# EAGLE design W506X (EAGLE 6.6.0)
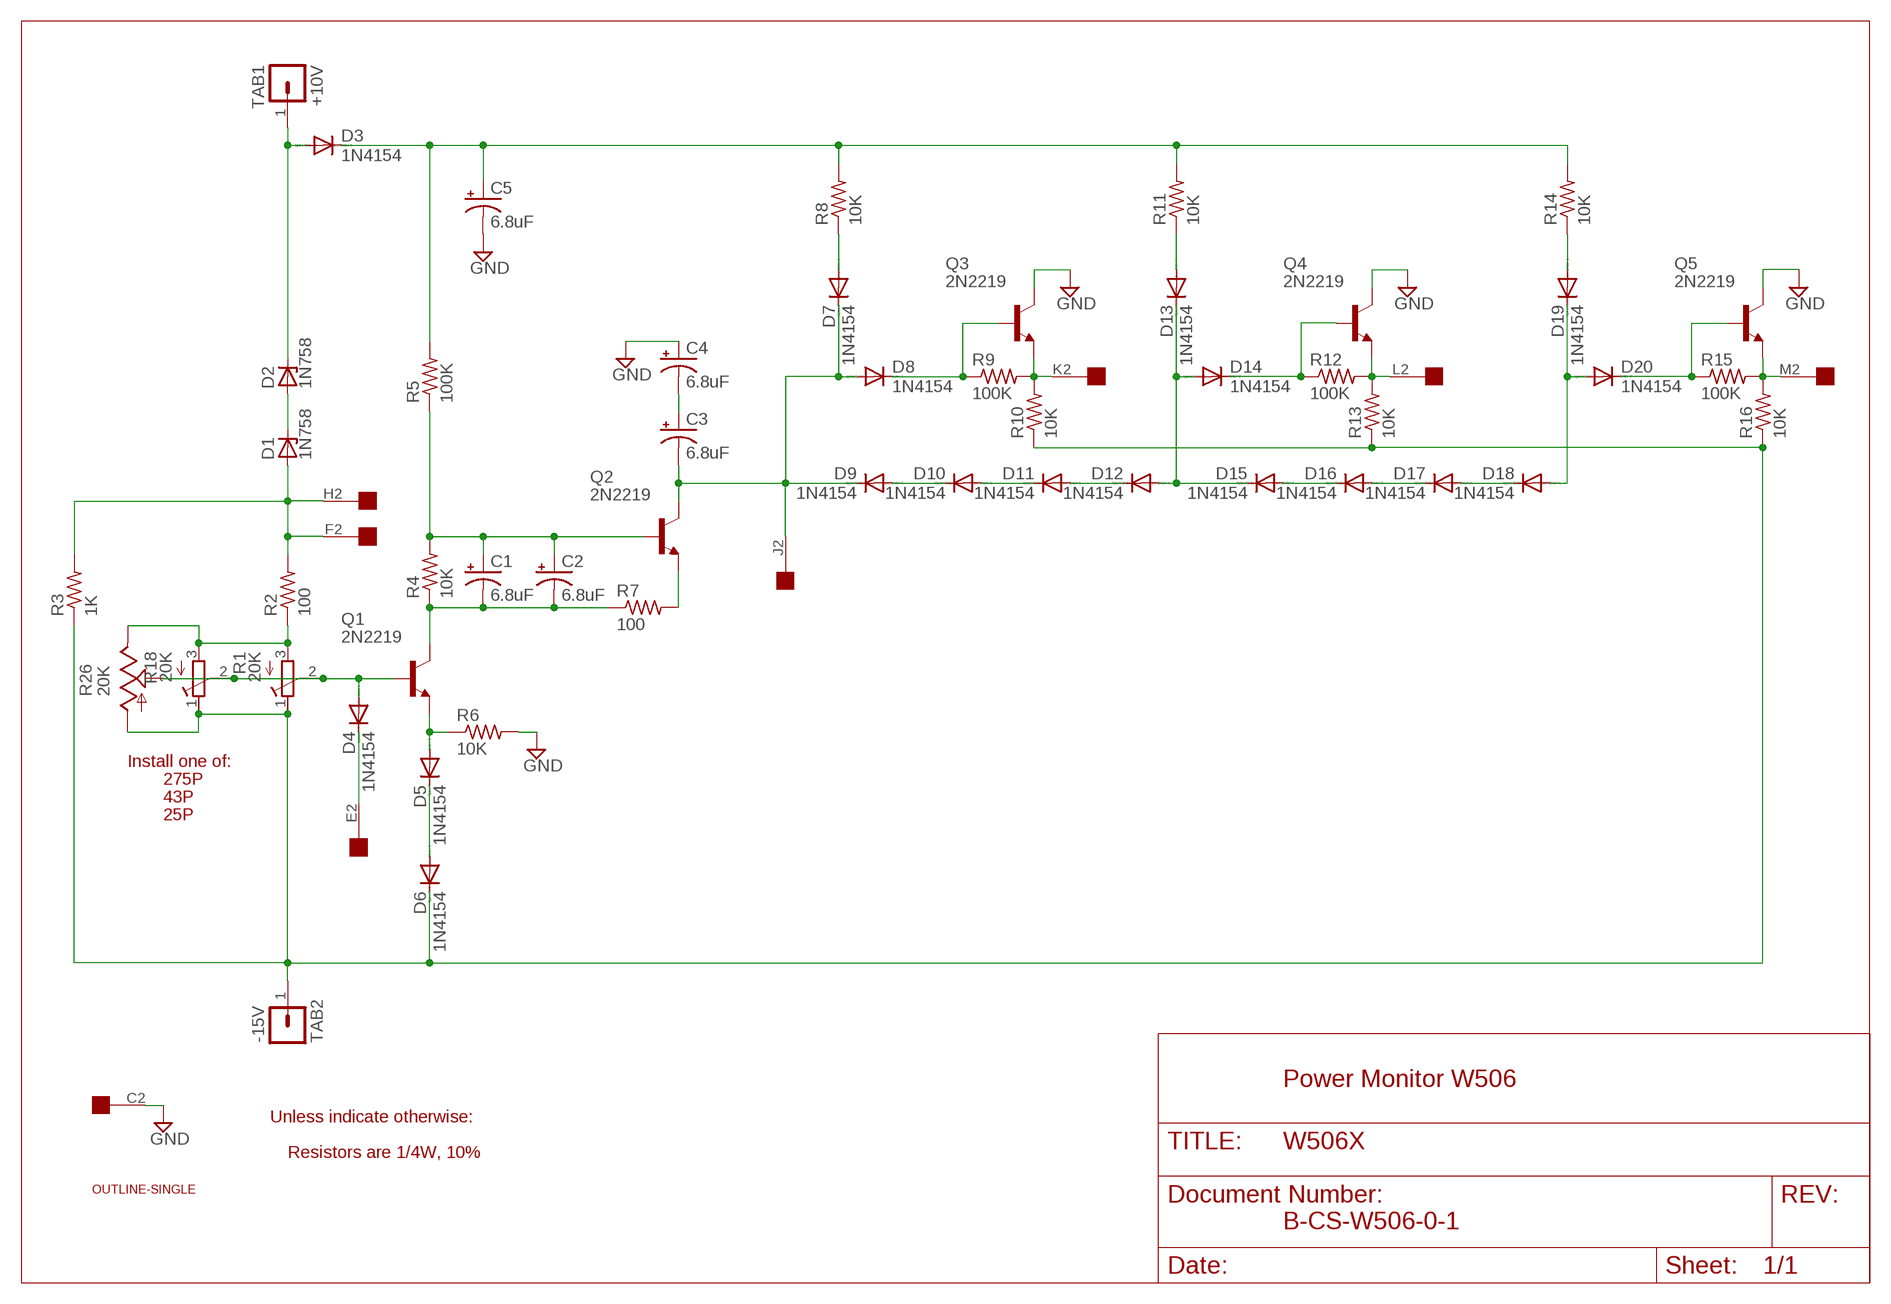
[diagram p0: schematic, sheet 1]

## Parts
C1  6.8uF  CPOL-USE15-5AXIAL  [E15-5]
C2  6.8uF  CPOL-USE15-5AXIAL  [E15-5]
C3  6.8uF  CPOL-USE15-5AXIAL  [E15-5]
C4  6.8uF  CPOL-USE15-5AXIAL  [E15-5]
C5  6.8uF  CPOL-USE15-5AXIAL  [E15-5]
D1  1N758  ZENER-DIODEDO35Z10  [DO35Z10]
D2  1N758  ZENER-DIODEDO35Z10  [DO35Z10]
D3  1N4154  1N4148DO35-10  [DO35-10]
D4  1N4154  1N4148DO35-10  [DO35-10]
D5  1N4154  1N4148DO35-10  [DO35-10]
D6  1N4154  1N4148DO35-10  [DO35-10]
D7  1N4154  1N4148DO35-10  [DO35-10]
D8  1N4154  1N4148DO35-10  [DO35-10]
D9  1N4154  1N4148DO35-10  [DO35-10]
D10  1N4154  1N4148DO35-10  [DO35-10]
D11  1N4154  1N4148DO35-10  [DO35-10]
D12  1N4154  1N4148DO35-10  [DO35-10]
D13  1N4154  1N4148DO35-10  [DO35-10]
D14  1N4154  1N4148DO35-10  [DO35-10]
D15  1N4154  1N4148DO35-10  [DO35-10]
D16  1N4154  1N4148DO35-10  [DO35-10]
D17  1N4154  1N4148DO35-10  [DO35-10]
D18  1N4154  1N4148DO35-10  [DO35-10]
D19  1N4154  1N4148DO35-10  [DO35-10]
D20  1N4154  1N4148DO35-10  [DO35-10]
EDGE  EDGE-1  [EDGE-CON1]
Q1  2N2219  2N2102  [TO5]
Q2  2N2219  2N2102  [TO5]
Q3  2N2219  2N2102  [TO5]
Q4  2N2219  2N2102  [TO5]
Q5  2N2219  2N2102  [TO5]
R1  20K  275P  [3006Y]
R2  100  R-US_0207/10  [0207/10]
R3  1K  R-US_0207/10  [0207/10]
R4  10K  R-US_0207/10  [0207/10]
R5  100K  R-US_0207/10  [0207/10]
R6  10K  R-US_0207/10  [0207/10]
R7  100  R-US_0207/10  [0207/10]
R8  10K  R-US_0207/10  [0207/10]
R9  100K  R-US_0207/10  [0207/10]
R10  10K  R-US_0207/10  [0207/10]
R11  10K  R-US_0207/10  [0207/10]
R12  100K  R-US_0207/10  [0207/10]
R13  10K  R-US_0207/10  [0207/10]
R14  10K  R-US_0207/10  [0207/10]
R15  100K  R-US_0207/10  [0207/10]
R16  10K  R-US_0207/10  [0207/10]
R18  20K  R-TRIMM43P  [RTRIM43P]
R26  20K  TRIM_US-B25P  [B25P]
TAB1  +10V  LUG  [SPADELUG]
TAB2  -15V  LUG  [SPADELUG]
U$1  OUTLINE-SINGLE  [SINGLE]

## Nets
+10V [Supply]: D2.C D3.A TAB1.1
-15V [Supply]: D6.C R1.1(A) R3.1 R10.1 R13.1 R16.1 R18.1(E) R26.A TAB2.1
GND [Supply]: C4.+ C5.- EDGE.C2 Q3.3(C) Q4.3(C) Q5.3(C) R6.2
N$1: R1.3(E) R2.1 R18.3(A) R26.E
N$2: D1.C D2.A
N$3: D1.A EDGE.F2 EDGE.H2 R2.2 R3.2
N$4: C1.- C2.- Q1.3(C) R4.1 R7.1
N$6: D4.A Q1.2(B) R1.2(S) R18.2(S) R26.S
N$7: D4.C EDGE.E2
N$8: D5.C D6.A
N$9: D5.A Q1.1(E) R6.1
N$10 [Supply]: C5.+ D3.C R5.2 R8.2 R11.2 R14.2
N$11: C1.+ C2.+ Q2.2(B) R4.2 R5.1
N$13: Q2.1(E) R7.2
N$14: C3.+ C4.-
N$15: EDGE.M2 Q5.1(E) R15.2 R16.2
N$16: C3.- D7.C D8.A D9.C EDGE.J2 Q2.3(C)
N$17: D9.A D10.C
N$18: D10.A D11.C
N$19: D11.A D12.C
N$20: D7.A R8.1
N$21: D8.C Q3.2(B) R9.1
N$23: EDGE.K2 Q3.1(E) R9.2 R10.2
N$24: D12.A D13.C D14.A D15.C
N$25: D13.A R11.1
N$26: EDGE.L2 Q4.1(E) R12.2 R13.2
N$27: D14.C Q4.2(B) R12.1
N$29: D15.A D16.C
N$30: D16.A D17.C
N$31: D17.A D18.C
N$33: D20.C Q5.2(B) R15.1
N$34: D19.A R14.1
N$35: D18.A D19.C D20.A
Unconnected: EDGE.A2 EDGE.B2 EDGE.D2 EDGE.N2 EDGE.P2 EDGE.R2 EDGE.S2 EDGE.T2 EDGE.U2 EDGE.V2

## Notes on the sheet
- Install one of:
- 275P
- 43P
- 25P
- Power Monitor W506
- Unless indicate otherwise:
- Resistors are 1/4W, 10%
- B-CS-W506-0-1

## Library data of the parts
C1-C5 = rcl:CPOL-US: POLARIZED CAPACITOR, American symbol
D1 D2 = diode:ZENER-DIODE: Z-Diode
D3-D20 = diode:1N4148: DIODE high speed (Philips)
EDGE = dec-con:EDGE-1: Single-Sided DEC Edge Connector -- (side 2)
Q1-Q5 = transistor-npn:2N2102: NPN Transistor
R1 = dec-con:275P: Trimpot with 275P (3006Y) footprint.
R2-R16 = rcl:R-US_: RESISTOR, American symbol
R18 = rcl:R-TRIMM: Trimm resistor
R26 = pot:TRIM_US-: POTENTIOMETER
TAB1 TAB2 = dec-con:LUG: Spade Lug
U$1 = dec-con:OUTLINE-*: Board outlines for DEC boards.

## Net classes
1 Supply: width 0.813 mm

## Board
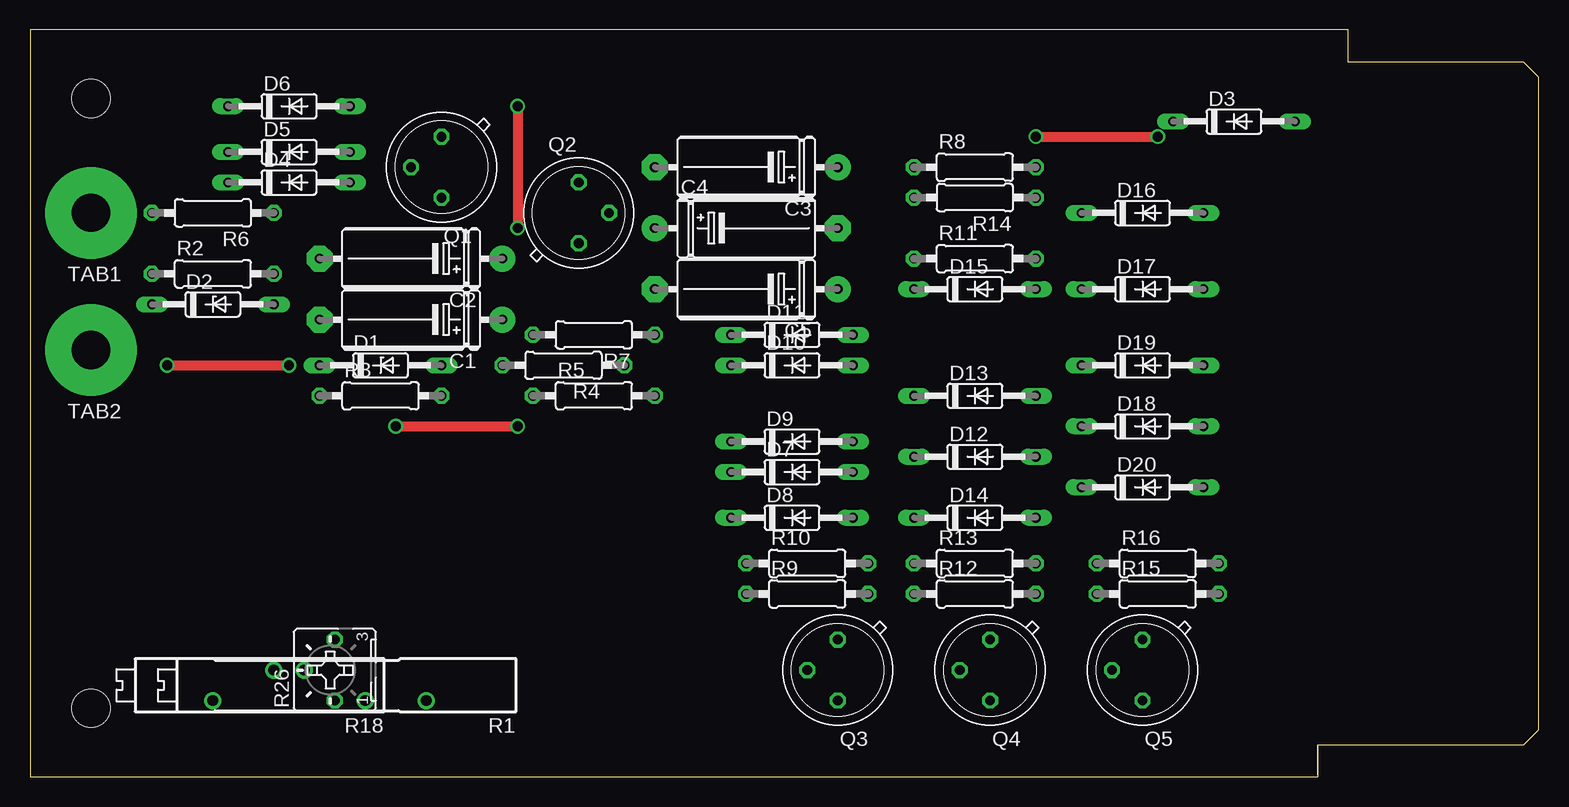
[diagram p1: board, top side]
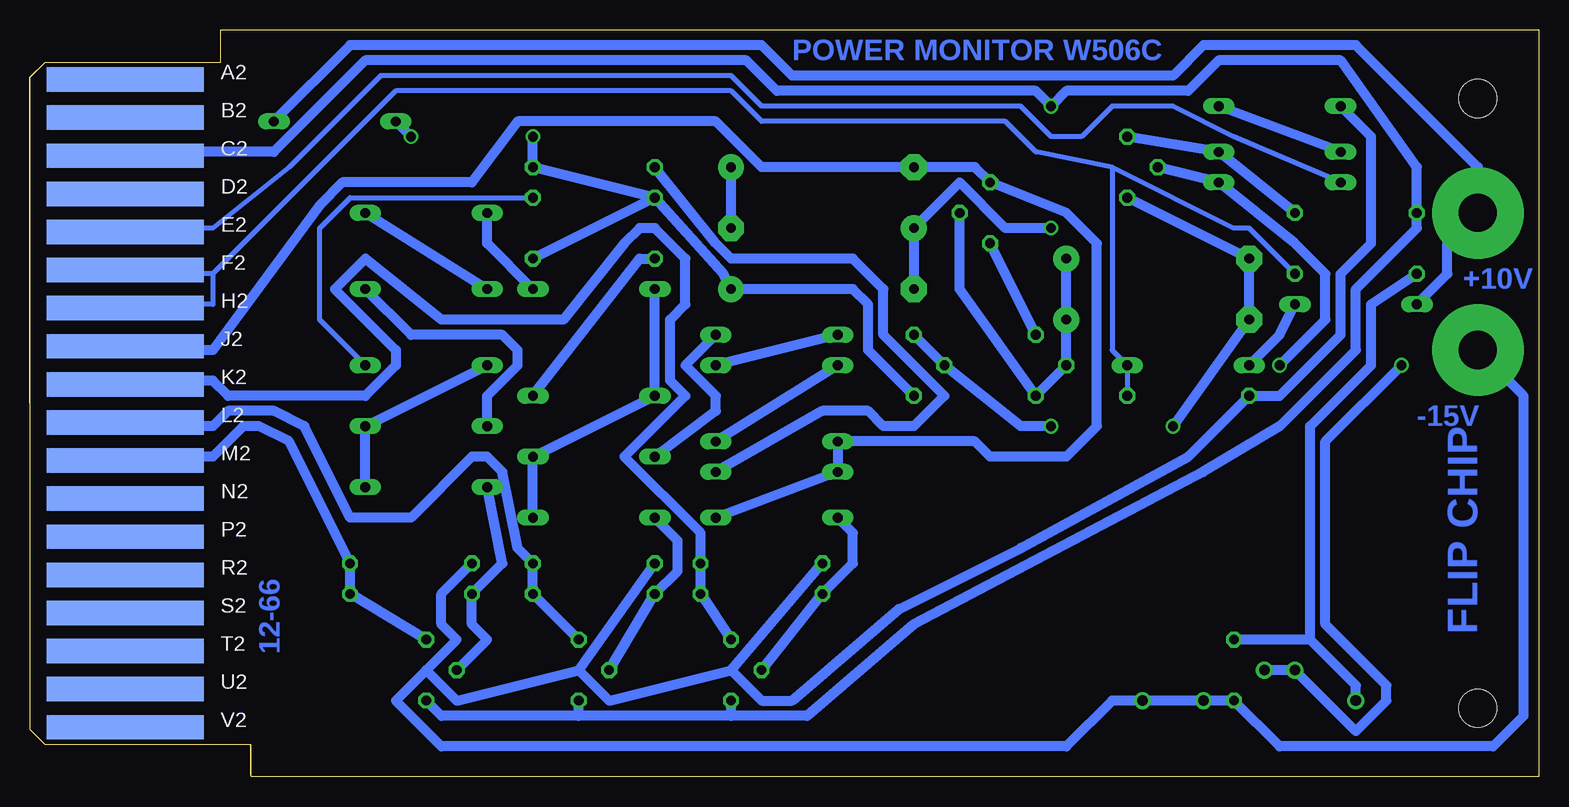
[diagram p2: board, bottom side, seen from below]

Size 125.73 x 62.23 mm. Coordinates in mm from the lower left corner, seen from the top.
Copper layers (1+16): Top 0.035mm / dielectric 1.5mm / Bottom 0.035mm
Design rules "16mils": minimum track width 16mil, minimum drill 32mil, track to track 15mil, track to pad 10mil, pad to pad 10mil, via to via 10mil, smd to smd 10mil, copper to edge 13mil, drill to drill 10mil, minimum pad ring 10mil, minimum via ring 8mil, stop-mask expansion 0mil, vias tented up to drill 0mil, thermal gap 10mil

### Footprints (pad centres in the part's own frame; a part is rotated, then mirrored left to right if it is on the bottom)
E15-5 = drill 0.813 pad 2.159: + -7.62,0 | drill 0.813 pad 2.159 octagon: - 7.62,0
DO35Z10 = drill 0.813 long: A 5.08,0; C -5.08,0
DO35-10 = drill 0.813 long: A 5.08,0; C -5.08,0
EDGE-CON1 = smd 13.106 x 2.032 bottom: A2 7.938,4.128; B2 7.938,7.303; C2 7.938,10.477; D2 7.938,13.652; E2 7.938,16.828; F2 7.938,20.003; H2 7.938,23.177; J2 7.938,26.352; K2 7.938,29.527; L2 7.938,32.703; M2 7.938,35.877; N2 7.938,39.053; P2 7.938,42.227; R2 7.938,45.403; S2 7.938,48.578; T2 7.938,51.752; U2 7.938,54.928; V2 7.938,58.102
TO5 = drill 0.813 octagon: 1 0,-2.54; 2 2.54,0; 3 0,2.54
3006Y = drill 0.9: 1 -8.89,1.27; 2 1.27,-1.27; 3 8.89,1.27
0207/10 = drill 0.813 octagon: 1 -5.08,0; 2 5.08,0
RTRIM43P = drill 0.9: 1 -7.62,1.27; 2 0,-1.27; 3 5.08,1.27
B25P = drill 0.813 octagon: A -2.54,0; E 2.54,0; S 0,2.54
SPADELUG = drill 3.175 pad 7.62: 1 0,0
SINGLE = hole 3.175: 120.65,56.515; 120.65,5.715

### Placement (x,y rotation side)
C1  31.75,38.1 180 top
C2  31.75,43.18 180 top
C3  59.69,50.8 180 top
C4  59.69,45.72 0 top
C5  59.69,40.64 180 top
D1  29.21,34.29 0 top
D2  15.24,39.37 0 top
D3  100.33,54.61 0 top
D4  21.59,49.53 0 top
D5  21.59,52.07 0 top
D6  21.59,55.88 0 top
D7  63.5,25.4 0 top
D8  63.5,21.59 0 top
D9  63.5,27.94 0 top
D10  63.5,34.29 0 top
D11  63.5,36.83 0 top
D12  78.74,26.67 0 top
D13  78.74,31.75 0 top
D14  78.74,21.59 0 top
D15  78.74,40.64 0 top
D16  92.71,46.99 0 top
D17  92.71,40.64 0 top
D18  92.71,29.21 0 top
D19  92.71,34.29 0 top
D20  92.71,24.13 0 top
EDGE  125.73,62.23 180 top
Q1  34.29,50.8 180 top
Q2  45.72,46.99 0 top
Q3  67.31,8.89 180 top
Q4  80.01,8.89 180 top
Q5  92.71,8.89 180 top
R1  24.13,7.62 180 top
R2  15.24,41.91 0 top
R3  29.21,31.75 0 top
R4  44.45,34.29 180 top
R5  46.99,31.75 0 top
R6  15.24,46.99 180 top
R7  46.99,36.83 180 top
R8  78.74,50.8 0 top
R9  64.77,15.24 0 top
R10  64.77,17.78 0 top
R11  78.74,43.18 0 top
R12  78.74,15.24 0 top
R13  78.74,17.78 0 top
R14  78.74,48.26 180 top
R15  93.98,15.24 0 top
R16  93.98,17.78 0 top
R18  20.32,7.62 180 top
R26  25.4,8.89 90 top
TAB1  5.08,46.99 180 top
TAB2  5.08,35.56 180 top
U$1  125.73,62.23 180 top
U$2  [FLIPCHIP]  2.54,48.26 180 bottom

### Tracks (layer width: path | path; a pad name or v marks a point on that pad's centre or on a via)
+10V
  Bottom 0.813: D2.C 7.62,41.91 7.62,44.45 TAB1.1 5.08,50.8 15.24,60.96 27.94,60.96 30.48,58.42 62.23,58.42 64.77,60.96 99.06,60.96 D3.A
-15V
  Bottom 0.813: TAB2.1 1.27,31.75 1.27,5.08 3.81,2.54 21.59,2.54 R26.A R18.1 R1.1 35.56,6.35 39.37,2.54 91.44,2.54 95.25,6.35 92.71,8.89 | 92.71,8.89 90.17,6.35 80.01,8.89 | 80.01,8.89 77.47,6.35 67.31,8.89 | 67.31,8.89 64.77,6.35 62.23,6.35 53.34,13.97 43.18,19.05 29.21,26.67 R3.1 21.59,31.75 16.51,36.83 16.51,41.91 13.97,44.45 13.97,53.34 D6.C | 92.71,8.89 90.17,11.43 91.44,12.7 91.44,15.24 R16.1 | 67.31,8.89 R10.1 | 80.01,8.89 R13.1
GND  (via drill 0.81)
  Top 0.813: v40.64,55.88 v40.64,45.72
  Bottom 0.813: Q5.3 91.44,5.08 80.01,5.08 | 67.31,5.08 80.01,5.08 | 80.01,5.08 Q4.3 | 67.31,5.08 Q3.3 | 67.31,5.08 60.96,5.08 52.07,12.7 27.94,25.4 21.59,29.21 15.24,35.56 15.24,40.64 10.16,45.72 R6.2 10.16,50.8 16.51,59.69 26.67,59.69 29.21,57.15 39.37,57.15 v40.64,55.88 41.91,57.15 63.5,57.15 66.04,59.69 97.79,59.69 105.41,52.07 116.84,52.07 117.17,51.74 EDGE.C2 | v40.64,45.72 44.45,45.72 48.26,49.53 C4.+ C5.-
N$1
  Bottom 0.813: R18.3 15.24,7.62 19.05,11.43 | 19.05,11.43 R26.E | R2.1 13.97,39.37 13.97,34.29 19.05,29.21 19.05,11.43
N$2
  Bottom 0.813: D1.C 21.59,36.83 D2.A
N$3
  Bottom 0.406: R3.2 D1.A 35.56,35.56 35.56,50.8 | EDGE.H2 116.84,39.37 110.49,39.37 110.49,41.91 | R2.2 24.13,45.72 25.4,45.72 35.56,50.8 | 35.56,50.8 41.91,52.07 44.45,54.61 64.77,54.61 67.31,57.15 95.25,57.15 110.49,41.91 | EDGE.F2 117.12,42.19 116.84,41.91 110.49,41.91
N$4  (via drill 0.81)
  Top 0.813: v30.48,29.21 v40.64,29.21
  Bottom 0.813: Q1.3 C2.- C1.- v30.48,29.21 | R7.1 R4.1 43.18,29.21 v40.64,29.21
N$6  (via drill 0.81)
  Top 0.813: v11.43,34.29 v21.59,34.29
  Bottom 0.813: R18.2 R26.S R18.2 | R18.2 15.24,3.81 12.7,6.35 12.7,7.62 17.78,12.7 17.78,27.94 v11.43,34.29 | Q1.2 D4.A 20.32,44.45 17.78,41.91 17.78,38.1 v21.59,34.29
N$7
  Bottom 0.406: D4.C 25.4,53.34 30.48,55.88 35.56,55.88 38.1,53.34 40.64,53.34 43.18,55.88 64.77,55.88 67.31,58.42 96.52,58.42 104.14,50.8 110.49,45.72 116.84,45.72 EDGE.E2
N$8
  Bottom 0.813: D5.C D6.A
N$9
  Bottom 0.813: R6.1 D5.A Q1.1
N$10  (via drill 0.81)
  Top 0.813: v83.82,53.34 v93.98,53.34
  Bottom 0.813: v83.82,53.34 R8.2 R14.2 | v93.98,53.34 D3.C | R5.2 55.88,35.56 55.88,39.37 57.15,40.64 C5.+ 67.94,41.91 R14.2 | R14.2 R11.2
N$11
  Bottom 0.813: C2.+ C1.+ R4.2 R5.1 48.26,40.64 Q2.2
N$13
  Bottom 0.813: R7.2 Q2.1
N$14
  Bottom 0.813: C4.- C3.+
N$15
  Bottom 0.813: Q5.1 R15.2 R16.2 104.14,27.94 106.68,29.21 107.95,29.21 110.49,26.67 116.84,26.67 EDGE.M2
N$16
  Bottom 0.813: D8.A D7.C D9.C 46.99,27.94 45.72,26.67 39.37,26.67 36.83,29.21 36.83,44.45 39.37,46.99 Q2.3 46.99,50.8 C3.- 64.77,50.8 68.58,54.61 85.09,54.61 88.9,49.53 99.69,49.53 101.6,47.62 110.49,35.56 116.84,35.56 EDGE.J2
N$17
  Bottom 0.813: D10.C D9.A
N$18
  Bottom 0.813: D11.C D10.A
N$19
  Bottom 0.813: D11.A 71.12,34.29 68.58,31.75 68.58,30.48 D12.C
N$20
  Bottom 0.813: D7.A 59.69,30.48 55.88,30.48 54.61,29.21 52.07,29.21 49.53,31.75 54.61,36.83 54.61,40.64 57.15,43.18 67.31,43.18 68.58,44.45 R8.1
N$21
  Bottom 0.813: D8.C 57.15,20.32 57.15,17.78 R9.1 Q3.2
N$23
  Bottom 0.813: Q3.1 R9.2 R10.2 69.85,20.32 76.2,26.67 71.12,31.75 72.39,33.02 72.39,38.1 71.12,39.37 71.12,43.18 73.66,45.72 74.93,45.72 76.2,44.45 81.28,38.1 91.44,38.1 97.79,43.18 100.33,40.64 95.25,35.56 95.25,34.29 97.79,31.75 109.22,31.75 110.49,33.02 116.84,33.02 EDGE.K2
N$24
  Bottom 0.813: D14.A D12.A D13.C D15.C
N$25
  Bottom 0.813: R11.1 74.93,43.18 D13.A
N$26
  Bottom 0.813: Q4.1 R12.2 R13.2 85.09,19.05 86.36,25.4 87.63,26.67 88.9,26.67 93.98,21.59 99.06,21.59 102.87,29.21 105.41,30.48 109.22,30.48 110.49,29.21 116.84,29.21 EDGE.L2
N$27
  Bottom 0.813: Q4.2 R12.1 71.75,17.14 71.75,19.68 D14.C
N$29
  Bottom 0.813: D15.A 87.63,44.45 D16.C
N$30
  Bottom 0.813: D17.C D16.A
N$31
  Bottom 0.813: D18.C 87.63,31.75 85.09,34.29 85.09,35.56 86.36,36.83 93.98,36.83 D17.A
N$33
  Bottom 0.813: Q5.2 87.63,11.43 88.9,12.7 R15.1 86.36,17.78 D20.C
N$34
  Bottom 0.406: R14.1 99.06,48.26 101.6,45.72 101.6,38.1 D19.A
N$35
  Bottom 0.813: D19.C D18.A D20.A

### Text on the board
Bottom: POWER MONITOR W506C | +10V | -15V | 12-66